# Altium project Handheld.PrjPcb (part 2 of 2)

## Sheet CC3351.SchDoc
size A3; SheetNumber: 8; SheetTotal: 10
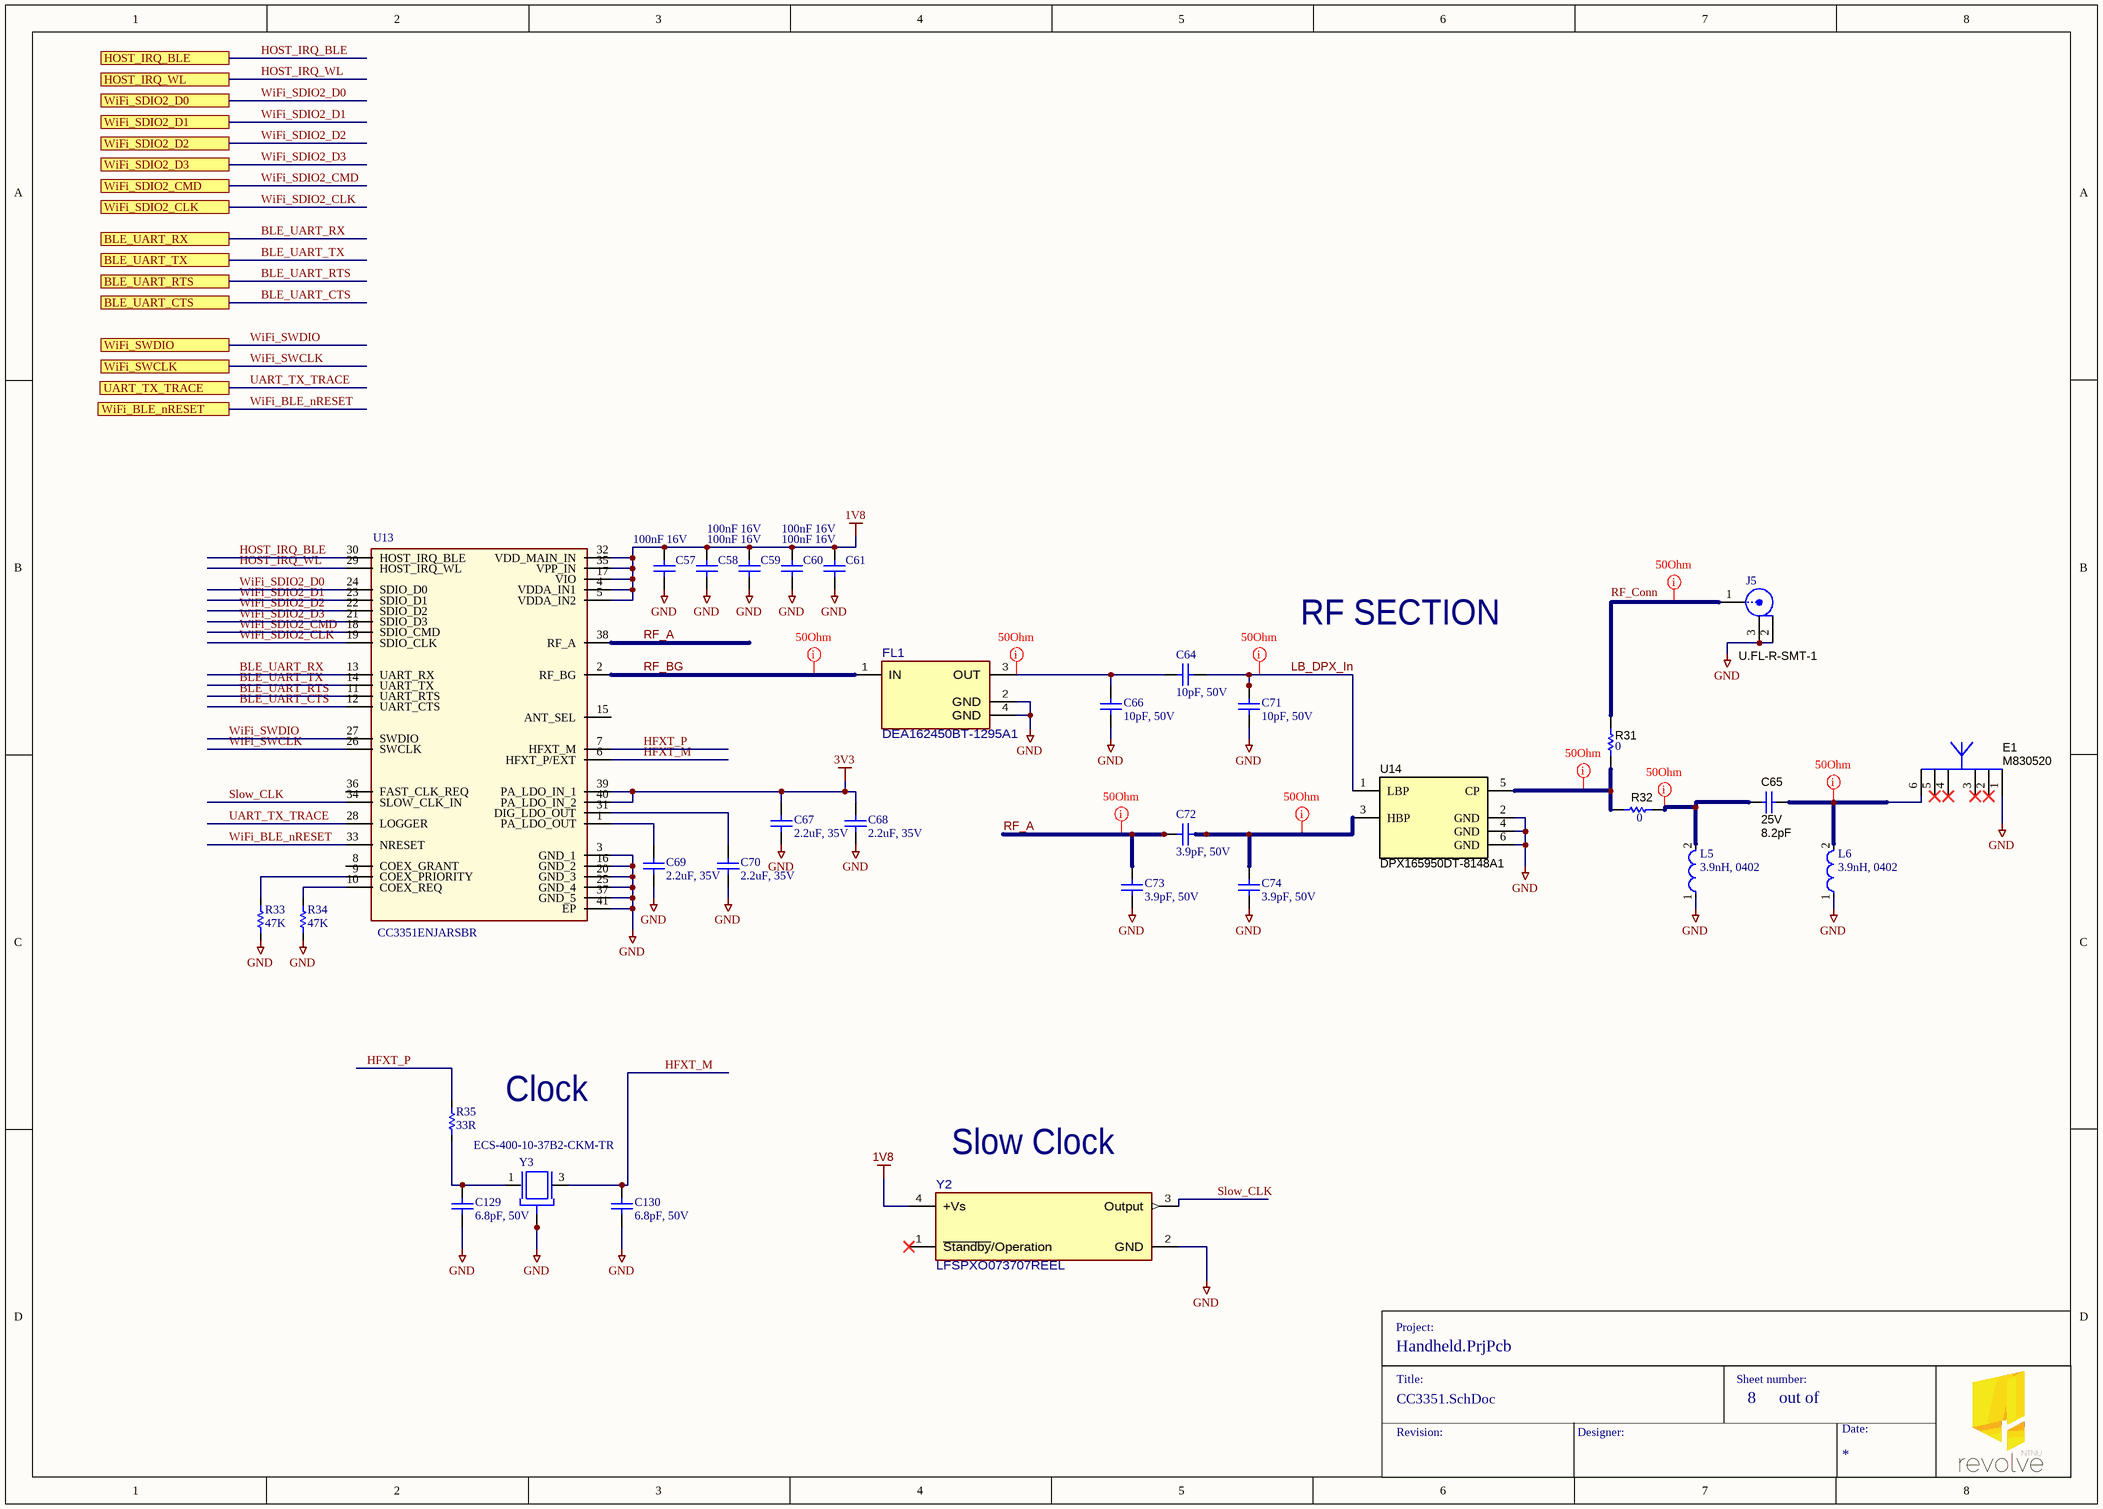
[diagram p7: CC3351.SchDoc]

### Parts
C57  100nF 16V  [0402]
C58  100nF 16V  [0402]
C59  100nF 16V  [0402]
C60  100nF 16V  [0402]
C61  100nF 16V  [0402]
C64  10pF, 50V  [0402 resistor]
C65  VDC_V: 25V  ValueDisplayed: 8.2pF  [0201]  (hidden comment: GJM0335C1E100JB01D)
C66  10pF, 50V  [0402 resistor]
C67  2.2uF, 35V  [0402 resistor]
C68  2.2uF, 35V  [0402 resistor]
C69  2.2uF, 35V  [0402 resistor]
C70  2.2uF, 35V  [0402 resistor]
C71  10pF, 50V  [0402 resistor]
C72  3.9pF, 50V  [0402 resistor]
C73  3.9pF, 50V  [0402 resistor]
C74  3.9pF, 50V  [0402 resistor]
C129  6.8pF, 50V  [0402 resistor]
C130  6.8pF, 50V  [0402 resistor]
E1  M830520  [Ethertronics_M830520]
FL1  DEA162450BT-1295A1  [FP-DEA162450BT-1295A1_SMT_FILTER_1MM60_0MM80-MFG]
J5  U.FL-R-SMT-1  [CONN_UFL-R-SMT-1]
L5  3.9nH, 0402  [INDC1005X55N]
L6  3.9nH, 0402  [INDC1005X55N]
R31  ValueDisplayed: 0  [0201]  (hidden comment: CRCW02010000Z0ED)
R32  ValueDisplayed: 0  [0201]  (hidden comment: CRCW02010000Z0ED)
R33  47K  [0603 Resistor]
R34  47K  [0603 Resistor]
R35  33R  [0603 Resistor]
U13  CC3351ENJARSBR  [RSB0040B-MFG]
U14  PartNumber: DPX165950DT-8148A1  [TDK_DPX165950DT-8148A1]  (hidden comment: CMP-0002040-1)
Y2  LFSPXO073707REEL  [FP-LFSPXO073707REEL_SMT4_2MM0_1MM6-MFG]
Y3  ECS-400-10-37B2-CKM-TR  [XTAL_ECS-400-10-37B2-CKM-TR]

### Ports
BLE_UART_CTS, BLE_UART_RTS, BLE_UART_RX, BLE_UART_TX, HOST_IRQ_BLE, HOST_IRQ_WL, UART_TX_TRACE, WiFi_BLE_nRESET, WiFi_SDIO2_CLK, WiFi_SDIO2_CMD, WiFi_SDIO2_D0, WiFi_SDIO2_D1, WiFi_SDIO2_D2, WiFi_SDIO2_D3, WiFi_SWCLK, WiFi_SWDIO

### Nets
1V8: C57.2 C58.2 C59.2 C60.2 C61.2 U13.4(VDDA_IN1) U13.5(VDDA_IN2) U13.17(VIO) U13.32(VDD_MAIN_IN) U13.35(VPP_IN) Y2.4(+Vs)
3V3: C67.2 C68.2 U13.39(PA_LDO_IN_1) U13.40(PA_LDO_IN_2)
GND: C57.1 C58.1 C59.1 C60.1 C61.1 C66.1 C67.1 C68.1 C69.1 C70.1 C71.1 C73.1 C74.1 C129.1 C130.1 E1.1(Feed) FL1.2(GND) FL1.4(GND) J5.2 J5.3 L5.1 L6.1 R33.2 R34.2 U13.3(GND_1) U13.16(GND_2) U13.20(GND_3) U13.25(GND_4) U13.37(GND_5) U13.41(EP) U14.2(GND) U14.4(GND) U14.6(GND) Y2.2(GND) Y3.2(GND) Y3.4(GND)
BLE_UART_CTS: U13.12(UART_CTS) ; port BLE_UART_CTS
BLE_UART_RTS: U13.11(UART_RTS) ; port BLE_UART_RTS
BLE_UART_RX: U13.13(UART_RX) ; port BLE_UART_RX
BLE_UART_TX: U13.14(UART_TX) ; port BLE_UART_TX
HFXT_M: C130.2 U13.6(HFXT_P/EXT) Y3.3(OUT/IN)
HFXT_P: R35.2 U13.7(HFXT_M)
HOST_IRQ_BLE: U13.30(HOST_IRQ_BLE) ; port HOST_IRQ_BLE
HOST_IRQ_WL: U13.29(HOST_IRQ_WL) ; port HOST_IRQ_WL
LB_DPX_In: C64.2 C71.2 U14.1(LBP)
RF_A: C72.2 C73.2 U13.38(RF_A)
RF_BG: FL1.1(IN) U13.2(RF_BG)
Slow_CLK: U13.34(SLOW_CLK_IN) Y2.3(Output)
UART_TX_TRACE: U13.28(LOGGER) ; port UART_TX_TRACE
WiFi_BLE_nRESET: U13.33(NRESET) ; port WiFi_BLE_nRESET
WiFi_SDIO2_CLK: U13.19(SDIO_CLK) ; port WiFi_SDIO2_CLK
WiFi_SDIO2_CMD: U13.18(SDIO_CMD) ; port WiFi_SDIO2_CMD
WiFi_SDIO2_D0: U13.24(SDIO_D0) ; port WiFi_SDIO2_D0
WiFi_SDIO2_D1: U13.23(SDIO_D1) ; port WiFi_SDIO2_D1
WiFi_SDIO2_D2: U13.22(SDIO_D2) ; port WiFi_SDIO2_D2
WiFi_SDIO2_D3: U13.21(SDIO_D3) ; port WiFi_SDIO2_D3
WiFi_SWCLK: U13.26(SWCLK) ; port WiFi_SWCLK
WiFi_SWDIO: U13.27(SWDIO) ; port WiFi_SWDIO
NetC64_1: C64.1 C66.2 FL1.3(OUT)
NetC65_1: C65.1 E1.6 L6.2
NetC65_2: C65.2 L5.2 R32.2
NetC69_2: C69.2 U13.1(PA_LDO_OUT)
NetC70_2: C70.2 U13.31(DIG_LDO_OUT)
NetC72_1: C72.1 C74.2 U14.3(HBP)
NetC129_2: C129.2 R35.1 Y3.1(IN/OUT)
NetJ5_1: J5.1 R31.2
NetR31_1: R31.1 R32.1 U14.5(CP)
NetR33_1: R33.1 U13.9(COEX_PRIORITY)
NetR34_1: R34.1 U13.10(COEX_REQ)

Not connected (* = marked no-connect by the designer): E1 2(GND)* 3(GND)* 4(Feed)* 5*; U13 8(COEX_GRANT) 15(ANT_SEL) 36(FAST_CLK_REQ); Y2 1(~{Standby}/Operation)*

### Layout directives
rule Undefined; net class RF: LB_DPX_In, NetC64_1, NetC65_1, NetC65_2, NetC72_1, NetJ5_1, NetR31_1, RF_A
rule Undefined: RF_BG

### Notes on the sheet
- RF SECTION
- Clock
- (near Y2) Slow Clock
- Labels drawn without touching a wire or pin: RF_Conn
- Project:
- Title:
- Sheet number:
- Revision:
- Designer:
- out of
- Date:

### Library data of the parts
C57-C61 = CMP-00017-A.2
C64 C66 C71 = CMP-00396-1: 10pF, 50V, 10%, 0402; Value: 10pF; Voltage Rating (DC): 50V
C65 = CMP-0064968-1: CAP, CERM, 8.2 pF, 25 V,+/- 1.2%, C0G/NP0, 0201; Manufacturer: MuRata; PartNumber: GRM0335C1E8R2BA01D; TaMin_C: -55°C; Polarized: N; SizeAreaWB_mm2: 2.08; Value1: Unknown; U/M: EA; Value: 8.2pF; TaMax_C: 125°C; SizeZ_mm: 0.26; SizeX_mm: 0.6; SizeY_mm: 0.3; SizeArea_mm2: 0.18; AEC Category: Q200; ComponentLink1URL: http://search.murata.co.jp/Ceramy/image/img/A01X/G101/ENG/GRM0335C1E8R2BA01-01.pdf; Supplier Part Number 2: 81-GRM0335C1E8R2BA1D; Publisher: Texas Instruments; Supplier 2: Mouser; TempCo: C0G/NP0; Published: 2008-06-19; RoHS: Y; MountType: SMT; Supplier 1: Digi-Key; PackageReference: 0201; Tolerance_%: 1.2%; Cap_Case: 0201; Value2: 25V; CompType: Capacitor; LatestRevisionDate: 2017-06-05; AEC Qualified: N; Cap_F: 8.2pF; ComponentLink1Description: Datasheet link; AEC Grade: N/A; Supplier Part Number 1: GRM0335C1E8R2BA01D; Technology: Ceramic
C67-C70 = CMP-001-P41-1: 2.2uF, 35V, 10%, 0402
C72-C74 = CMP-00395-1: 3.9pF, 50V, 10%, 0402; Voltage Rating (DC): 50V
C129 C130 = CMP-00397-1: 6.8pF, 50V, 10%, 0402; Voltage Rating (DC): 50V; Value: 6.8pF
E1 = CMP-0001857-1: WLAN ANTENNA 802.11, SMD; Manufacturer: Ethertronics; Alternate Manufacturer: ----; SizeAreaWB_mm2: 50; SizeArea_mm2: 24; SizeX_mm: 3; SizeY_mm: 8; SizeZ_mm: 1.33; PartNumber: M830520; CompType: Antenna; MountType: SMT; ComponentLink1Description: Datasheet URL; ComponentLink1URL: http://www.ethertronics.com/files/6014/0708/4228/Savvi_WLAN__8x3_M830510.pdf; RoHS: Y; PackageReference: 8x3mm; Publisher: Texas Instruments; LatestRevisionDate: 09/03/2017; Alternate PartNumber: ----
FL1 = CMP-0091509-1: 2.45GHz Center Frequency Band Pass RF Filter (Radio Frequency) 100MHz Bandwidth 1.8dB 0603 (1608 Metric), 3 PC Pad; Manufacturer: TDK; Bandwidth: 2400-2500MHz; AEC Qualified: No; Insertion Loss: 1.95dB; SizeZ_mm: 0.7mm; RoHS: TRUE; Operating Temperature Range: -40°C to +85°C; datasheet: https://product.tdk.com/info/en/documents/data_sheet/rf_bpf_dea162450bt-1295a1_en.pdf; PackageReference: SMT_FILTER_1MM60_0MM80; Frequency_Fixed: 2.45GHz; helpURL: https://upverter.com/upn/revision/67a1f53e71daea06/; ComponentLink1Description: Datasheet; Mouser Part Number: 810-DEA162450BT1295A; Part Number: DEA162450BT-1295A1; Datasheet Path: datasheets/Filter-DEA162450BT-1295A1.pdf; Lead Free: Yes; PartNumber: DEA162450BT-1295A1; Filter Type: Band Pass; Mouser Description: RF Filter Band Pass 2450MHz 2400MHz to 2500MHz 1.95dB 50Ohm SMD 4Pin 0603 T/R; Digikey Description: RF FILTER BAND PASS 2.45GHZ 0603; ComponentLink1URL: https://product.tdk.com/info/en/documents/data_sheet/rf_bpf_dea162450bt-1295a1_en.pdf; Digikey Part Number: 445-175610-1-ND
J5 = CMP-0075320-1: Receptacle, Ultra Miniature Coaxial, Male Pin, 50 ohm, SMT; Manufacturer: Hirose Electric Co. Ltd.; PartNumber: U.FL-R-SMT-1(01); CNHeader: False; Gender: Female; ContactFinish: Gold; ComponentLink1URL: https://www.hirose.com/product/en/download_file/key_name/U.FL%2DR%2DSMT%2D1%2801%29/category/Drawing%20(2D)/doc_file_id/37625/?file_category_id=6&item_id=03310472201&is_series=; Supplier Part Number 2: 18K7517; Publisher: Texas Instruments; Supplier 2: Newark; Supplier Part Number 3: 798-U.FL-R-SMT01; Color: Beige; Supplier 3: Mouser; RoHS: Y; MountType: SMT; Supplier 1: Digi-Key; PackageReference: Ultra small CO-AX SMD; PinCount: 3; CompType: Receptacle; LatestRevisionDate: 2017-07-12; Orientation: Vertical; ComponentLink1Description: Datasheet URL; Supplier Part Number 1: H122041-ND; CT: False
L5 L6 = Inductor SMD 3.9nH: 3.9 nH Unshielded Multilayer Inductor 750 mA 140mOhm Max 0402 (1005 Metric); DC Resistance (DCR): 175mR; Max DC Current: 1.1A; Inductance Tolerance: 30%; Self Resonant Frequency: 20MHz; Inductance: 4.7uH; Test Frequency: 1MHz; Core Material: Ferrite; Case Code (Metric): 2016; Min Operating Temperature: -40°C; Width: 1.6mm; Depth: 1.6mm; Max Operating Temperature: 125°C; Length: 2mm; Case Code (Imperial): 0806; Case/Package: 0806; Tolerance: 30%; Military Standard: Not; Current Rating: 1.1A; Packaging: Tape and Reel; Package Quantity: 1; Shielding: Shielded; Lead Free: Lead Free; Termination: SMD/SMT; Height - Seated (Max): 0.039inch; REACH SVHC: No SVHC; Mount: Surface Mount; DC Current: 1.1A; Height: 0.9mm; Supplier 1: DigiKey; Supplier Part Number 1: 490-LQG15HS3N9B02DCT-ND
R31 R32 = CMP-0027008-4: RES, 0, 5%, 0.05 W, 0201; Manufacturer: Vishay-Dale; Power_W: 50mW; TempCo: ppm/C; Value_Code: 0000; Value: 0; EIA_Code: E24; SizeX_mm: 0.6; SizeY_mm: 0.3; SizeZ_mm: 0.26; Value2: 0.05W; SizeArea_mm2: 0.18; AEC Qualified: N; AEC Category: Q200; RoHS: E; Value1: 5%; MountType: SMT; Supplier 1: Newark; PackageReference: 0201; Tolerance_%: 5%; Res_ohm: 0; CompType: Resistor; PartNumber: CRCW02010000Z0ED; ComponentLink1Description: Datasheet link; AEC Grade: N/A; Supplier Part Number 1: 72M6743; Technology: Thick Film; ComponentLink1URL: http://www.vishay.com/docs/20052/crcw0201e3.pdf
R33 R34 = CMP-001-B87-6: 47K, 1%, 1/10W, 0603
R35 = CMP-001-C30-7: 33R, 1%, 1/10W, 0603; Manufacturer: Panasonic; Manufacturer Part Number: ERJ-3EKF33R0V; Temperature Coefficient: 100ppm/°C; Max Power Dissipation: 100mW; Voltage Rating: 75V; REACH SVHC: No SVHC; Resistance: 33R; Composition: Thick Film; Tolerance: 1%; Lead Free: Lead Free; Contact Plating: Tin; Package Quantity: 1; Number of Terminations: 2; Number of Pins: 2; Case Code (Metric): 1608; Width: 0.031inch; Min Operating Temperature: -55°C; Military Standard: Not; Termination: SMD/SMT; Radiation Hardening: No; Case Code (Imperial): 0603; Mount: Surface Mount; Depth: 0.8mm; Max Operating Temperature: 155°C; Voltage Rating (DC): 75V; Features: Automotive AEC-Q200; Power Rating: 100mW; Packaging: Tape and Reel; Supplier Part Number: P33.0HCT-ND; Length: 1.6mm; Supplier: Digi-Key; Height: 0.022inch; Case/Package: 0603
U13 = CC3351ENJARSBR: Wi-Fi 6 (802.11ax)  Bluetooth Low Energy 5.4 in CC33x1 devices  Companion IC to any processor or MCU host capable of running a TCP/IP stack  Integrated 2.4GHz and 5GHz PA for complete wireless solution with up to +20.5dBm output power.  Operating temperature: 40C to +105C  Application throughput up to 50Mbps; Manufacturer_Name: Texas Instruments; Geometry.Height: 0.8mm; Manufacturer_Part_Number: CC3351ENJARSBR; Mouser Part Number: 595-CC3351ENJARSBR; Mouser Price/Stock: https://www.mouser.co.uk/ProductDetail/Texas-Instruments/CC3351ENJARSBR?qs=iLKYxzqNS77FIPECga1PlQ%3D%3D; Arrow Part Number: CC3351ENJARSBR; Arrow Price/Stock: https://www.arrow.com/en/products/cc3351enjarsbr/texas-instruments?utm_currency=USD&region=nac; Datasheet Link: https://www.ti.com/lit/ds/symlink/cc3351.pdf?ts=1729762003874&ref_url=https%253A%252F%252Fwww.ti.com%252F
U14 = CMP-0002040-1: Multilayer Diplexer for 2.4GHz W-LAN & Bluetooth / 5GHz W-LAN; Manufacturer: TDK; Alternate Manufacturer: ----; SizeAreaWB_mm2: 4.68; SizeArea_mm2: 1.28; SizeX_mm: 0.8; SizeY_mm: 1.6; SizeZ_mm: 0.7; CompType: Diplexer; MountType: SMT; ComponentLink1Description: Datasheet URL; ComponentLink1URL: https://sps06.itg.ti.com/sites/KMS/crossdivteams/altium/docs/ComponentDatasheets/DPX165950DT-8148A1.pdf; RoHS: Y; PackageReference: 1.6x0.8mm; Publisher: Texas Instruments; LatestRevisionDate: 09/03/2017; Alternate PartNumber: ----; Supplier 1: Digi-Key; Supplier Part Number 1: 445-174759-1-ND; Supplier 2: Mouser; Supplier Part Number 2: 810-DPX16595DT8148A1
Y2 = CMP-0094366-1: 32.768 kHz XO (Standard) CMOS Oscillator 1.8V Enable/Disable 4-SMD, No Lead; Manufacturer: IQD Frequency Products; Frequency Stability: 100ppm; Max Supply Voltage: 1.89V; Load Capacitance: 15pF; Min Supply Voltage: 1.71V; Max Supply Current: 0.2mA; SizeZ_mm: 0.8mm; ComponentLink1URL: https://www.iqdfrequencyproducts.com/products/pn/LFSPXO073707Reel.pdf; Operating Temperature Range: -40°C to +125°C; AEC Qualified: No; helpURL: https://upverter.com/upn/revision/c85886b3b224eb15/; Lead Free: Yes; Series: IQXO-404; PackageReference: SMT4_2MM0_1MM6; Part Number: LFSPXO073707REEL; Datasheet Path: datasheets/Crys-LFSPXO073707REEL.pdf; ComponentLink1Description: Datasheet; datasheet: https://www.iqdfrequencyproducts.com/products/pn/LFSPXO073707Reel.pdf; Frequency_Fixed: 32.768kHz; Digikey Part Number: 1923-1619-1-ND; Supplier 1: Digikey; Digikey Description: XTAL OSC XO 32.7680KHZ CMOS SMD; Supplier Part Number 1: 1923-1619-1-ND; PartNumber: LFSPXO073707REEL; Supplier Part Number 2: 449-LFSPXO073707REEL; Mouser Part Number: 449-LFSPXO073707REEL; Supplier 2: Mouser; RoHS: TRUE
Y3 = ECS-400-10-37B2-CKM-TR: Crystal 40MHz ±10ppm (Tol) ±10ppm (Stability) 10pF FUND 40Ohm 4-Pin Mini-CSMD T/R; MF: ECS Inc.; SnapEDA_Link: https://www.snapeda.com/parts/ECS-400-10-37B2-CKM-TR/ECS+Inc./view-part/?ref=snap; Package: ECX-1637B-37B-4 ECS; Value: *; MP: ECS-400-10-37B2-CKM-TR; Check_prices: https://www.snapeda.com/parts/ECS-400-10-37B2-CKM-TR/ECS+Inc./view-part/?ref=eda

## Sheet LR2021.SchDoc
size A3; SheetNumber: 9; SheetTotal: 10
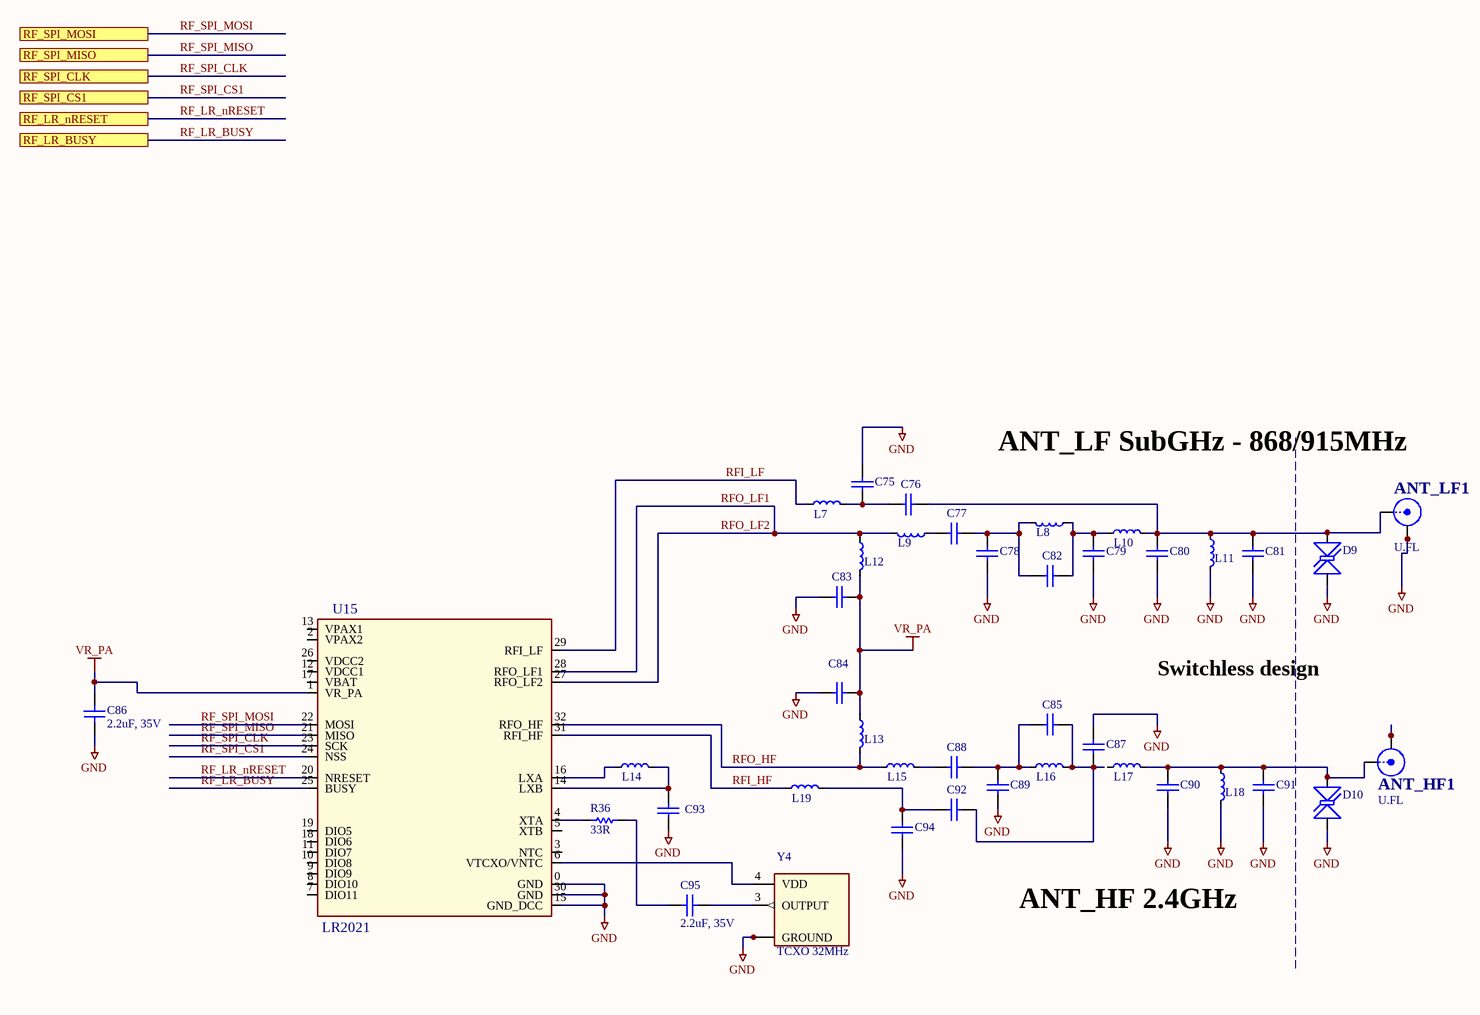
[diagram p8: LR2021.SchDoc]

### Parts
ANT_HF1  U.FL  [U.FL-R-SMT Hirose_2337019-1]
ANT_LF1  U.FL  [U.FL-R-SMT Hirose_2337019-1]
C75  Cap  [c_201_smd]  (value not drawn)
C76  Cap  [c_201_smd]  (value not drawn)
C77  Cap  [c_201_smd]  (value not drawn)
C78  Cap  [c_201_smd]  (value not drawn)
C79  Cap  [c_201_smd]  (value not drawn)
C80  Cap  [c_201_smd]  (value not drawn)
C81  Cap  [c_201_smd]  (value not drawn)
C82  Cap  [c_201_smd]  (value not drawn)
C83  Cap  [c_201_smd]  (value not drawn)
C84  Cap  [c_201_smd]  (value not drawn)
C85  Cap  [c_201_smd]  (value not drawn)
C86  2.2uF, 35V  [0402 resistor]
C87  Cap  [c_201_smd]  (value not drawn)
C88  Cap  [c_201_smd]  (value not drawn)
C89  Cap  [c_201_smd]  (value not drawn)
C90  Cap  [c_201_smd]  (value not drawn)
C91  Cap  [c_201_smd]  (value not drawn)
C92  Cap  [c_201_smd]  (value not drawn)
C93  Cap  [c_201_smd]  (value not drawn)
C94  Cap  [c_201_smd]  (value not drawn)
C95  2.2uF, 35V  [0402 resistor]
D9  TVS Diode  [SLP0603P2X3F]  (value not drawn)
D10  TVS Diode  [SLP0603P2X3F]  (value not drawn)
L7  Inductor symbol  [LQW_201_smd]  (value not drawn)
L8  Inductor symbol  [LQW_201_smd]  (value not drawn)
L9  Inductor symbol  [LQW_201_smd]  (value not drawn)
L10  Inductor symbol  [LQW_201_smd]  (value not drawn)
L11  Inductor symbol  [LQW_201_smd]  (value not drawn)
L12  Inductor symbol  [lqw_402_smd]  (value not drawn)
L13  Inductor symbol  [LQW_201_smd]  (value not drawn)
L14  Inductor symbol  [LQM18P_603_INDUCTOR_SMD]  (value not drawn)
L15  Inductor symbol  [LQW_201_smd]  (value not drawn)
L16  Inductor symbol  [LQW_201_smd]  (value not drawn)
L17  Inductor symbol  [LQW_201_smd]  (value not drawn)
L18  Inductor symbol  [LQW_201_smd]  (value not drawn)
L19  Inductor symbol  [LQW_201_smd]  (value not drawn)
R36  33R  [0603 Resistor]
U15  LR2021  [qfn32l_5x5mm]
Y4  TCXO 32MHz  [XTAL_ECS-400-10-37B2-CKM-TR]

### Ports
RF_LR_BUSY, RF_LR_nRESET, RF_SPI_CLK, RF_SPI_CS1, RF_SPI_MISO, RF_SPI_MOSI

### Nets
GND: ANT_LF1.2(GND) ANT_LF1.3(GND) C75.1 C78.1 C79.1 C80.1 C81.2 C83.1 C84.1 C86.2 C87.1 C89.1 C90.1 C91.1 C93.1 C94.1 D9.1(A) D10.1(A) L11.2 L18.2 U15.0(GND) U15.15(GND_DCC) U15.30(GND) Y4.1(GROUND) Y4.2(GROUND)
VR_PA: C83.2 C84.2 C86.1 L12.1 L13.1 U15.1(VR_PA)
RF_LR_BUSY: U15.25(BUSY) ; port RF_LR_BUSY
RF_LR_nRESET: U15.20(NRESET) ; port RF_LR_nRESET
RF_SPI_CLK: U15.23(SCK) ; port RF_SPI_CLK
RF_SPI_CS1: U15.24(NSS) ; port RF_SPI_CS1
RF_SPI_MISO: U15.21(MISO) ; port RF_SPI_MISO
RF_SPI_MOSI: U15.22(MOSI) ; port RF_SPI_MOSI
RFI_HF: L19.2 U15.31(RFI_HF)
RFI_LF: L7.1 U15.29(RFI_LF)
RFO_HF: L13.2 L15.1 U15.32(RFO_HF)
RFO_LF1: L9.1 L12.2 U15.27(RFO_LF2) U15.28(RFO_LF1)  [also labelled RFO_LF2]
NetANT_HF1_1: ANT_HF1.1(Signal) C90.2 C91.2 D10.2(K) L17.2 L18.1
NetANT_HF1_2: ANT_HF1.2(GND) ANT_HF1.3(GND)
NetANT_LF1_1: ANT_LF1.1(Signal) C76.2 C80.2 C81.1 D9.2(K) L10.2 L11.1
NetC75_2: C75.2 C76.1 L7.2
NetC77_1: C77.1 L9.2
NetC77_2: C77.2 C78.2 C82.1 L8.1
NetC79_2: C79.2 C82.2 L8.2 L10.1
NetC85_1: C85.1 C88.2 C89.2 L16.1
NetC85_2: C85.2 C87.2 C92.2 L16.2
NetC88_1: C88.1 L15.2
NetC92_1: C92.1 C94.2 L19.1
NetC93_2: C93.2 L14.2 U15.14(LXB)
NetC95_1: C95.1 Y4.3(OUTPUT)
NetC95_2: C95.2 R36.2
NetL14_1: L14.1 U15.16(LXA)
NetR36_1: R36.1 U15.4(XTA)
NetU15_6: U15.6(VTCXO/VNTC) Y4.4(VDD)

Not connected (* = marked no-connect by the designer): L17 1; U15 2(VPAX2) 3(NTC) 5(XTB) 7(DIO11) 8(DIO10) 9(DIO9) 10(DIO8) 11(DIO7) 12(VDCC1) 13(VPAX1) 17(VBAT) 18(DIO6) 19(DIO5) 26(VDCC2)

### Notes on the sheet
- ANT_LF SubGHz - 868/915MHz
- Switchless design
- ANT_HF 2.4GHz
- Project:
- Title:
- Sheet number:
- Revision:
- Designer:
- out of
- Date:

### Library data of the parts
ANT_HF1 ANT_LF1 = U.FL: U.FL Hirose RF Connector; LatestRevisionDate: 21-Feb-2012  -  Semtech
C75-C85 C87-C92 C94 = Cap: Capacitor SMD; Value: VAL?; Published: 8-Jun-2000; LatestRevisionDate: 05-oct-2007  -  Semtech; LatestRevisionNote: Re-released for DXP Platform.; Publisher: Altium Limited
C86 C95 = CMP-001-P41-1: 2.2uF, 35V, 10%, 0402
C93 = Cap: Capacitor SMD; Published: 8-Jun-2000; LatestRevisionDate: 05-oct-2007  -  Semtech; LatestRevisionNote: Re-released for DXP Platform.; Publisher: Altium Limited; Value: ?
D9 D10 = TVS Diode: Ultra Low Capacitance 1-line ESD Protection; LatestRevisionDate: 23-Aug-2016; Type: TVS Diode
L7-L13 L15-L19 = Inductor: Code_IEC: 1005; Value: VAL?; Published: 15-Jun-2021; LatestRevisionDate: 15-Jun-2021 -  Semtech; LatestRevisionNote: Re-released for DXP Platform.; Publisher: Altium Limited; Code_JEITA: 0402
L14 = Inductor_DC-DC: Inductor for DC-DC; Code_IEC: 1005; Published: 15-Jun-2021; LatestRevisionDate: 15-Jun-2021 -  Semtech; LatestRevisionNote: Re-released for DXP Platform.; Publisher: Altium Limited; Code_JEITA: 0402; Value: ?
R36 = CMP-001-C30-7: as R35 on sheet CC3351; REACH SVHC: No SVHC; Resistance: 33R; Composition: Thick Film; Tolerance: 1%; Lead Free: Lead Free; Contact Plating: Tin; Package Quantity: 1; Number of Terminations: 2; Number of Pins: 2; Case Code (Metric): 1608; Width: 0.031inch; Min Operating Temperature: -55°C; Military Standard: Not; Termination: SMD/SMT; Radiation Hardening: No; Case Code (Imperial): 0603; Mount: Surface Mount; Depth: 0.8mm; Max Operating Temperature: 155°C; Voltage Rating (DC): 75V; Features: Automotive AEC-Q200; Power Rating: 100mW; Packaging: Tape and Reel; Supplier Part Number: P33.0HCT-ND; Length: 1.6mm; Supplier: Digi-Key; Height: 0.022inch; Case/Package: 0603
U15 = LR2021: LR2021 - Low Power Integrated Low Power Multi protocol Transceiver; LatestRevisionDate: 27-Jul-2009 -  Semtech
Y4 = ECSTXO20CSMV320EYTR: 32 MHz TCXO Clipped Sine Wave Oscillator 1.7V ~ 3.465V - 4-SMD, No Lead; MF: ECS Inc.; MP: ECS-TXO-20CSMV-320-EY-TR; SnapEDA_Link: https://www.snapeda.com/parts/ECS-TXO-20CSMV-320-EY-TR/ECS/view-part/?ref=snap; Package: ECS-TXO-20CSMV-0-4 ECS; Value: *; Check_prices: https://www.snapeda.com/parts/ECS-TXO-20CSMV-320-EY-TR/ECS/view-part/?ref=eda; Supplier 1: DigiKey; Supplier Part Number 1: 50-ECS-TXO-20CSMV-320-EY-CT-ND

## Sheet ST25R.SchDoc
size A3; SheetNumber: 10; SheetTotal: 10
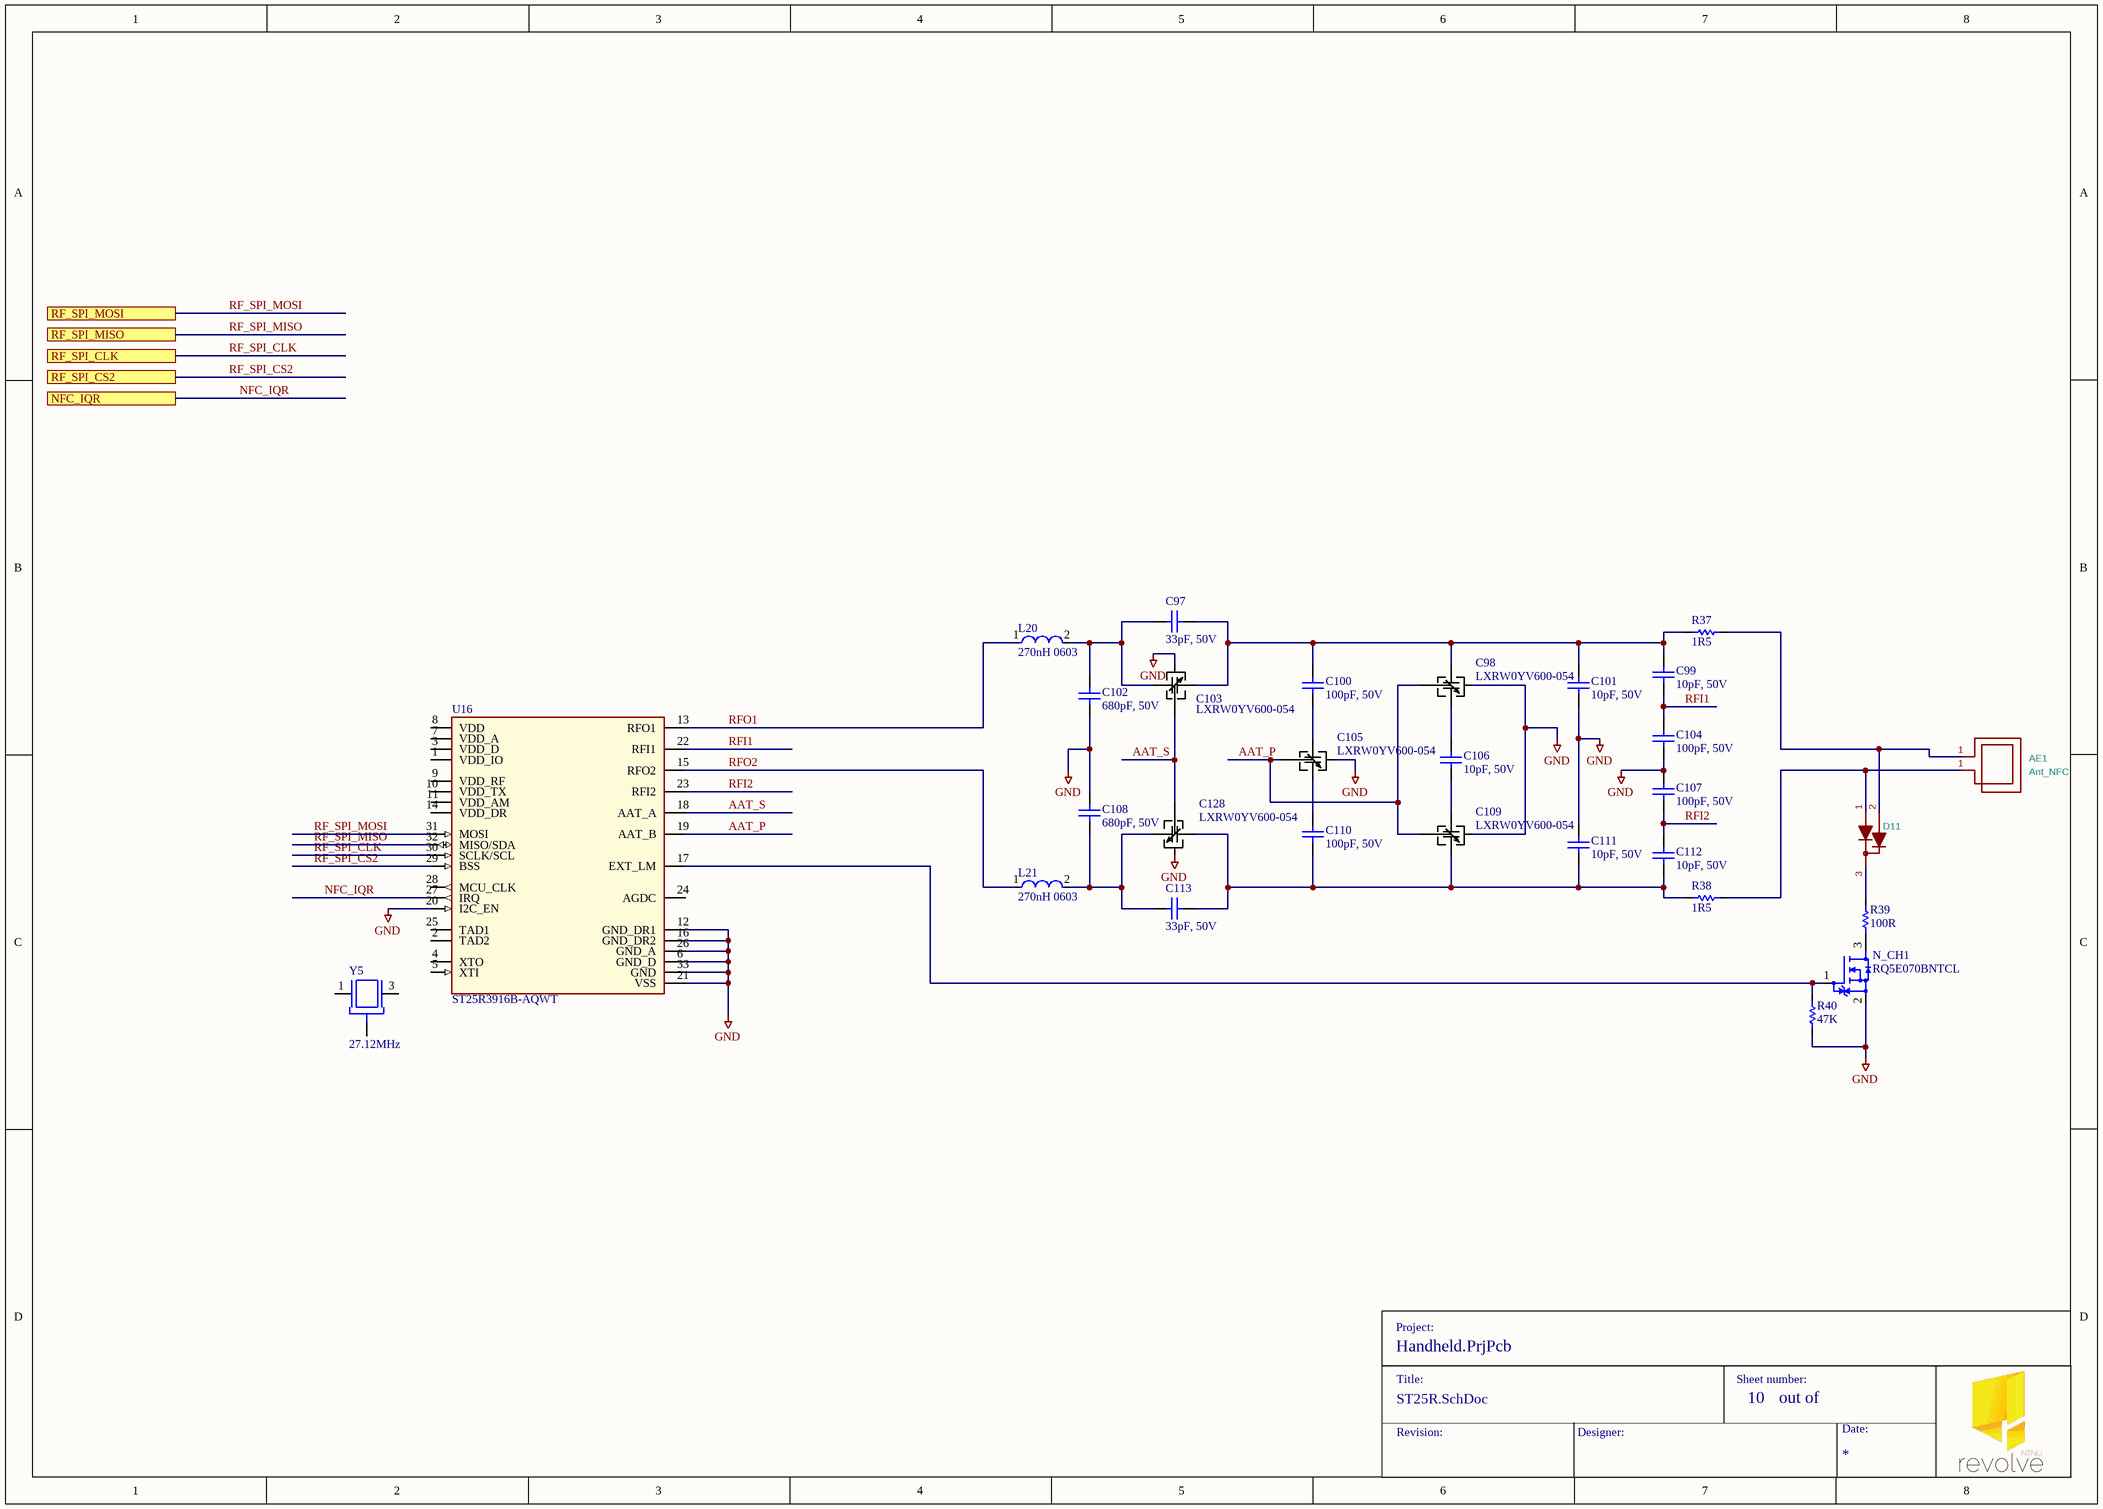
[diagram p9: ST25R.SchDoc]

### Parts
AE1  Ant_NFC  [Jarvis_NFC_Ant]
C97  33pF, 50V  [0402 resistor]
C98  LXRW0YV600-054  [LXRW0_MUR-M]
C99  10pF, 50V  [0402 resistor]
C100  100pF, 50V  [0402 resistor]
C101  10pF, 50V  [0402 resistor]
C102  680pF, 50V  [0402 resistor]
C103  LXRW0YV600-054  [LXRW0_MUR-M]
C104  100pF, 50V  [0402 resistor]
C105  LXRW0YV600-054  [LXRW0_MUR-M]
C106  10pF, 50V  [0402 resistor]
C107  100pF, 50V  [0402 resistor]
C108  680pF, 50V  [0402 resistor]
C109  LXRW0YV600-054  [LXRW0_MUR-M]
C110  100pF, 50V  [0402 resistor]
C111  10pF, 50V  [0402 resistor]
C112  10pF, 50V  [0402 resistor]
C113  33pF, 50V  [0402 resistor]
C128  LXRW0YV600-054  [LXRW0_MUR-M]
D11  BAV70W-7-F  [SOT65P210X100-3N]  (value not drawn)
L20  270nH 0603  [INDC1608X95N]
L21  270nH 0603  [INDC1608X95N]
N_CH1  RQ5E070BNTCL  [RTR040N03HZGTL-Footprint-1]
R37  1R5  [RESC1005X40X25ML05T05]
R38  1R5  [RESC1005X40X25ML05T05]
R39  100R  [RESC1005X40X25ML05T05]
R40  47K  [0603 Resistor]
U16  ST25R3916B-AQWT  [VFQFPN32_5X5_WETTABLE_STM-M]
Y5  27.12MHz  [XTAL_ECS-400-10-37B2-CKM-TR]

### Ports
NFC_IQR, RF_SPI_CLK, RF_SPI_CS2, RF_SPI_MISO, RF_SPI_MOSI

### Nets
GND: C98.1(GND) C101.1 C102.1 C103.1(GND) C104.1 C105.1(GND) C107.2 C108.2 C109.1(GND) C111.2 C128.1(GND) N_CH1.2(S) R40.1 U16.6(GND_D) U16.12(GND_DR1) U16.16(GND_DR2) U16.20(I2C_EN) U16.21(VSS) U16.26(GND_A) U16.33(GND)
AAT_P: C98.2(VT) C105.2(VT) C109.2(VT) U16.19(AAT_B)
AAT_S: C103.2(VT) C128.2(VT) U16.18(AAT_A)
NFC_IQR: U16.27(IRQ) ; port NFC_IQR
RF_SPI_CLK: U16.30(SCLK/SCL) ; port RF_SPI_CLK
RF_SPI_CS2: U16.29(BSS) ; port RF_SPI_CS2
RF_SPI_MISO: U16.32(MISO/SDA) ; port RF_SPI_MISO
RF_SPI_MOSI: U16.31(MOSI) ; port RF_SPI_MOSI
RFI1: C99.1 C104.2 U16.22(RFI1)
RFI2: C107.1 C112.2 U16.23(RFI2)
RFO1: L20.1 U16.13(RFO1)
RFO2: L21.1 U16.15(RFO2)
NetAE1_1: AE1.1 D11.1 R38.2
NetAE1_1: AE1.1 D11.2 R37.2  [a separate net that carries the same name]
NetC97_1: C97.1 C102.2 C103.3(PORT1) L20.2
NetC97_2: C97.2 C98.3(PORT1) C99.2 C100.2 C101.2 C103.4(PORT2) R37.1
NetC98_4: C98.4(PORT2) C106.2
NetC100_1: C100.1 C105.3(PORT1)
NetC105_4: C105.4(PORT2) C110.2
NetC106_1: C106.1 C109.3(PORT1)
NetC108_1: C108.1 C113.1 C128.4(PORT2) L21.2
NetC109_4: C109.4(PORT2) C110.1 C111.1 C112.1 C113.2 C128.3(PORT1) R38.1
NetD11_3: D11.3 R39.2
NetN_CH1_1: N_CH1.1(G) R40.2 U16.17(EXT_LM)
NetN_CH1_3: N_CH1.3(D) R39.1
NetY5_2: Y5.2(GND) Y5.4(GND)

Not connected (* = marked no-connect by the designer): U16 1(VDD_IO) 2(TAD2) 3(VDD_D) 4(XTO) 5(XTI) 7(VDD_A) 8(VDD) 9(VDD_RF) 10(VDD_TX) 11(VDD_AM) 14(VDD_DR) 24(AGDC) 25(TAD1) 28(MCU_CLK); Y5 1(IN/OUT) 3(OUT/IN)

### Notes on the sheet
- Project:
- Title:
- Sheet number:
- Revision:
- Designer:
- out of
- Date:

### Library data of the parts
C97 C113 = CMP-00399-1: 50V 33pF C0G ±1% 0402 Multilayer Ceramic Capacitors MLCC - SMD/SMT ROHS; Max Operating Temperature: 125°C; Case/Package: 0402; Voltage Rating (DC): 50V; Voltage Rating: 50V; Min Operating Temperature: -55°C; Value: 33pF; Tolerance: 1%
C98 C103 C105 C109 C128 = LXRW0YV600: Variable capacitor 30-60pF; Supplier 1: DigiKey; Supplier Part Number 1: 490-18379-1-ND
C99 C101 C106 C111 C112 = CMP-00396-1: 10pF, 50V, 10%, 0402; Value: 10pF; Voltage Rating (DC): 50V
C100 C104 C107 C110 = CMP-001-O95-2: 100pF, 50V, Tolerance, Temperature, 0402
C102 C108 = CMP-00398-1: Ceramic Capacitor, Multilayer, Ceramic, 50V, 1% +Tol, 1% -Tol, C0G, 30ppm/Cel TC, 0.00068uF, Surface Mount, 0402; Value: 680pF; Voltage Rating (DC): 50V; Min Operating Temperature: -55°C; Tolerance: 1%; Voltage Rating: 50V; Max Operating Temperature: 125°C
D11 = BAV70W-7-F: Manufacturer_Name: Diodes Incorporated; Height: 1; Manufacturer_Part_Number: BAV70W-7-F; Value: BAV70W-7-F
L20 L21 = Inductor SMD 270nH: Multilayer Type Inductor for Power Lines, 0603, 270nH, 30%, 0.286Ω, 500mA, MLJ1608WR27JT000; DC Resistance (DCR): 175mR; Max DC Current: 1.1A; Self Resonant Frequency: 20MHz; Inductance: 4.7uH; Test Frequency: 1MHz; Core Material: Ferrite; Shielding: Shielded; Case Code (Metric): 2016; Min Operating Temperature: -40°C; Width: 1.6mm; Depth: 1.6mm; Inductance Tolerance: 30%; Max Operating Temperature: 125°C; Length: 2mm; Case Code (Imperial): 0806; Case/Package: 0806; Tolerance: 30%; Military Standard: Not; Current Rating: 1.1A; Packaging: Tape and Reel; Package Quantity: 1; Lead Free: Lead Free; Termination: SMD/SMT; Height - Seated (Max): 0.039inch; REACH SVHC: No SVHC; Mount: Surface Mount; DC Current: 1.1A; Height: 0.9mm; Supplier 1: Newark; Supplier Part Number 1: MLJ1608WR27JT000
N_CH1 = CMP-001-Q89.0.1: Small Signal Field-Effect Transistor, 7A I(D), 30V, 1-Element, N-Channel, Silicon, Metal-oxide Semiconductor FET; Reach SVHC Compliant: Yes; RoHS Compliant: Yes; Moisture Sensitivity Level: 1
R37 R38 = CMP-001-R15-2: 1R5 1% 1/8W, 0402; Temperature Coefficient: 200ppm/°C; Voltage Rating (DC): 50V; Max Power Dissipation: 63mW; Mounting Technology: Surface Mount; Tolerance: 1%; Case/Package: 0402; Voltage Rating: 50V
R39 = CMP-00400-1: 100R 1% 1/8W, 0402; Max Power Dissipation: 63mW; Temperature Coefficient: 100ppm/°C; Voltage Rating: 50V; Mounting Technology: Surface Mount; Tolerance: 1%; Case/Package: 0402; Voltage Rating (DC): 50V
R40 = CMP-001-B87-6: 47K, 1%, 1/10W, 0603
U16 = ST25R3916B-AQWT: NFC reader for payment, consumer and industrial; Manufacturer_Name: STMicroelectronics; Type: RFID, RF Access, Monitoring ICs; Copyright: Copyright (C) 2025 Ultra Librarian. All rights reserved.; Manufacturer_Part_Number: ST25R3916B-AQWT; RefDes: RefDes
Y5 = ECS-271.2-10-37-CKM-TR: Crystal 27.12MHz ±10ppm (Tol) ±10ppm (Stability) 10pF FUND 60Ohm 4-Pin Mini-CSMD T/R; MF: ECS Inc.; MP: ECS-400-10-37B2-CKM-TR; SnapEDA_Link: https://www.snapeda.com/parts/ECS-400-10-37B2-CKM-TR/ECS+Inc./view-part/?ref=snap; Package: ECX-1637B-37B-4 ECS; Value: *; Check_prices: https://www.snapeda.com/parts/ECS-400-10-37B2-CKM-TR/ECS+Inc./view-part/?ref=eda; Supplier 1: DigiKey; Supplier Part Number 1: XC2511CT-ND
AE1 = Ant_NFC: Value: Ant_NFC; Footprint: Lol_20230821:Jarvis_NFC_Ant

## Nets that join several sheets
1V8: MCU (6 pins), Power (6 pins), Wireless (U10.2), CC3351 (11 pins)
3V3: Main (C17.2 R9.1 U2.9), MCU (30 pins), Power (10 pins), DebugUSB (6 pins), Wireless (U10.4 U10.14), CC3351 (C67.2 C68.2 U13.39 U13.40)
GND: Main (C17.1 SW1.3 U2.3), MCU (72 pins), MMI (5 pins), Power (47 pins), DebugUSB (9 pins), CC3351 (36 pins), LR2021 (25 pins), ST25R (20 pins)
BLE_UART_CTS: MCU (U1.95), CC3351 (U13.12)
BLE_UART_RTS: MCU (U1.94), CC3351 (U13.11)
BLE_UART_RX: MCU (U1.93), CC3351 (U13.13)
BLE_UART_TX: MCU (U1.92), CC3351 (U13.14)
Debug_USB_DM: Main (U2.4), DebugUSB (R12.1)
Debug_USB_DP: Main (U2.5), DebugUSB (R11.1)
ESP32_EN: MCU (U1.103), DebugUSB (U8.26)
Hard_Reset_ALL: MCU (R45.1 R46.1 R47.1), MMI (U11.10)
HOST_IRQ_BLE: MCU (U1.25), CC3351 (U13.30)
HOST_IRQ_WL: MCU (U1.24), CC3351 (U13.29)
KEY_nIQR: MCU (U1.12), MMI (U12.24)
MTCK: MCU (U1.2), DebugUSB (U8.22)
MTDI: MCU (U1.3), DebugUSB (U8.23)
MTDO: MCU (U1.5), DebugUSB (U8.24)
MTMS: MCU (U1.4), DebugUSB (U8.25)
RF_LR_nRESET: MCU (R45.2), LR2021 (U15.20)
RF_SPI_CLK: MCU (U1.8), LR2021 (U15.23), ST25R (U16.30)
RF_SPI_CS1: MCU (U1.11), LR2021 (U15.24)
RF_SPI_MISO: MCU (U1.7), LR2021 (U15.21), ST25R (U16.32)
RF_SPI_MOSI: MCU (U1.6), LR2021 (U15.22), ST25R (U16.31)
SHDN_0V9FPGA: MMI (U11.11), Power (R48.1 U4.9)
TCK: FPGA (U6.K3), DebugUSB (U8.12)
TDI: FPGA (U6.K5), DebugUSB (U8.13)
TDO: FPGA (U6.J4), DebugUSB (U8.14)
TMS: FPGA (U6.K4), DebugUSB (U8.15)
UART_RX_P4: MCU (U1.16), DebugUSB (U8.33)
UART_TX_P4: MCU (U1.15), DebugUSB (U8.32)
USB_DM: Main (U2.2), Power (J1.A7 J1.B7 R43.1)
USB_DP: Main (U2.1), Power (J1.A6 J1.B6 R42.1)
USB_ESP_M: Main (U2.6), MCU (R27.2)
USB_ESP_P: Main (U2.7), MCU (R26.2)
Util_nRESET: MCU (U1.1), MMI (U11.15 U12.20)
Util_SCL: MCU (R16.1 U1.13), MMI (U11.14 U12.23 U18.19), Power (U7.B6), Wireless (U10.17)
Util_SDA: MCU (R15.1 U1.14), MMI (U11.13 U12.22 U18.18), Power (U7.C6), Wireless (U10.19)
WiFi_BLE_nRESET: MCU (R46.2), CC3351 (U13.33)
WiFi_SDIO2_CLK: MCU (U1.22), CC3351 (U13.19)
WiFi_SDIO2_CMD: MCU (U1.23), CC3351 (U13.18)
WiFi_SDIO2_D0: MCU (U1.17), CC3351 (U13.24)
WiFi_SDIO2_D1: MCU (U1.18), CC3351 (U13.23)
WiFi_SDIO2_D2: MCU (U1.19), CC3351 (U13.22)
WiFi_SDIO2_D3: MCU (U1.20), CC3351 (U13.21)